# EAGLE schematic MySens-GWeasySensRS485-003 (EAGLE 7.6.0)
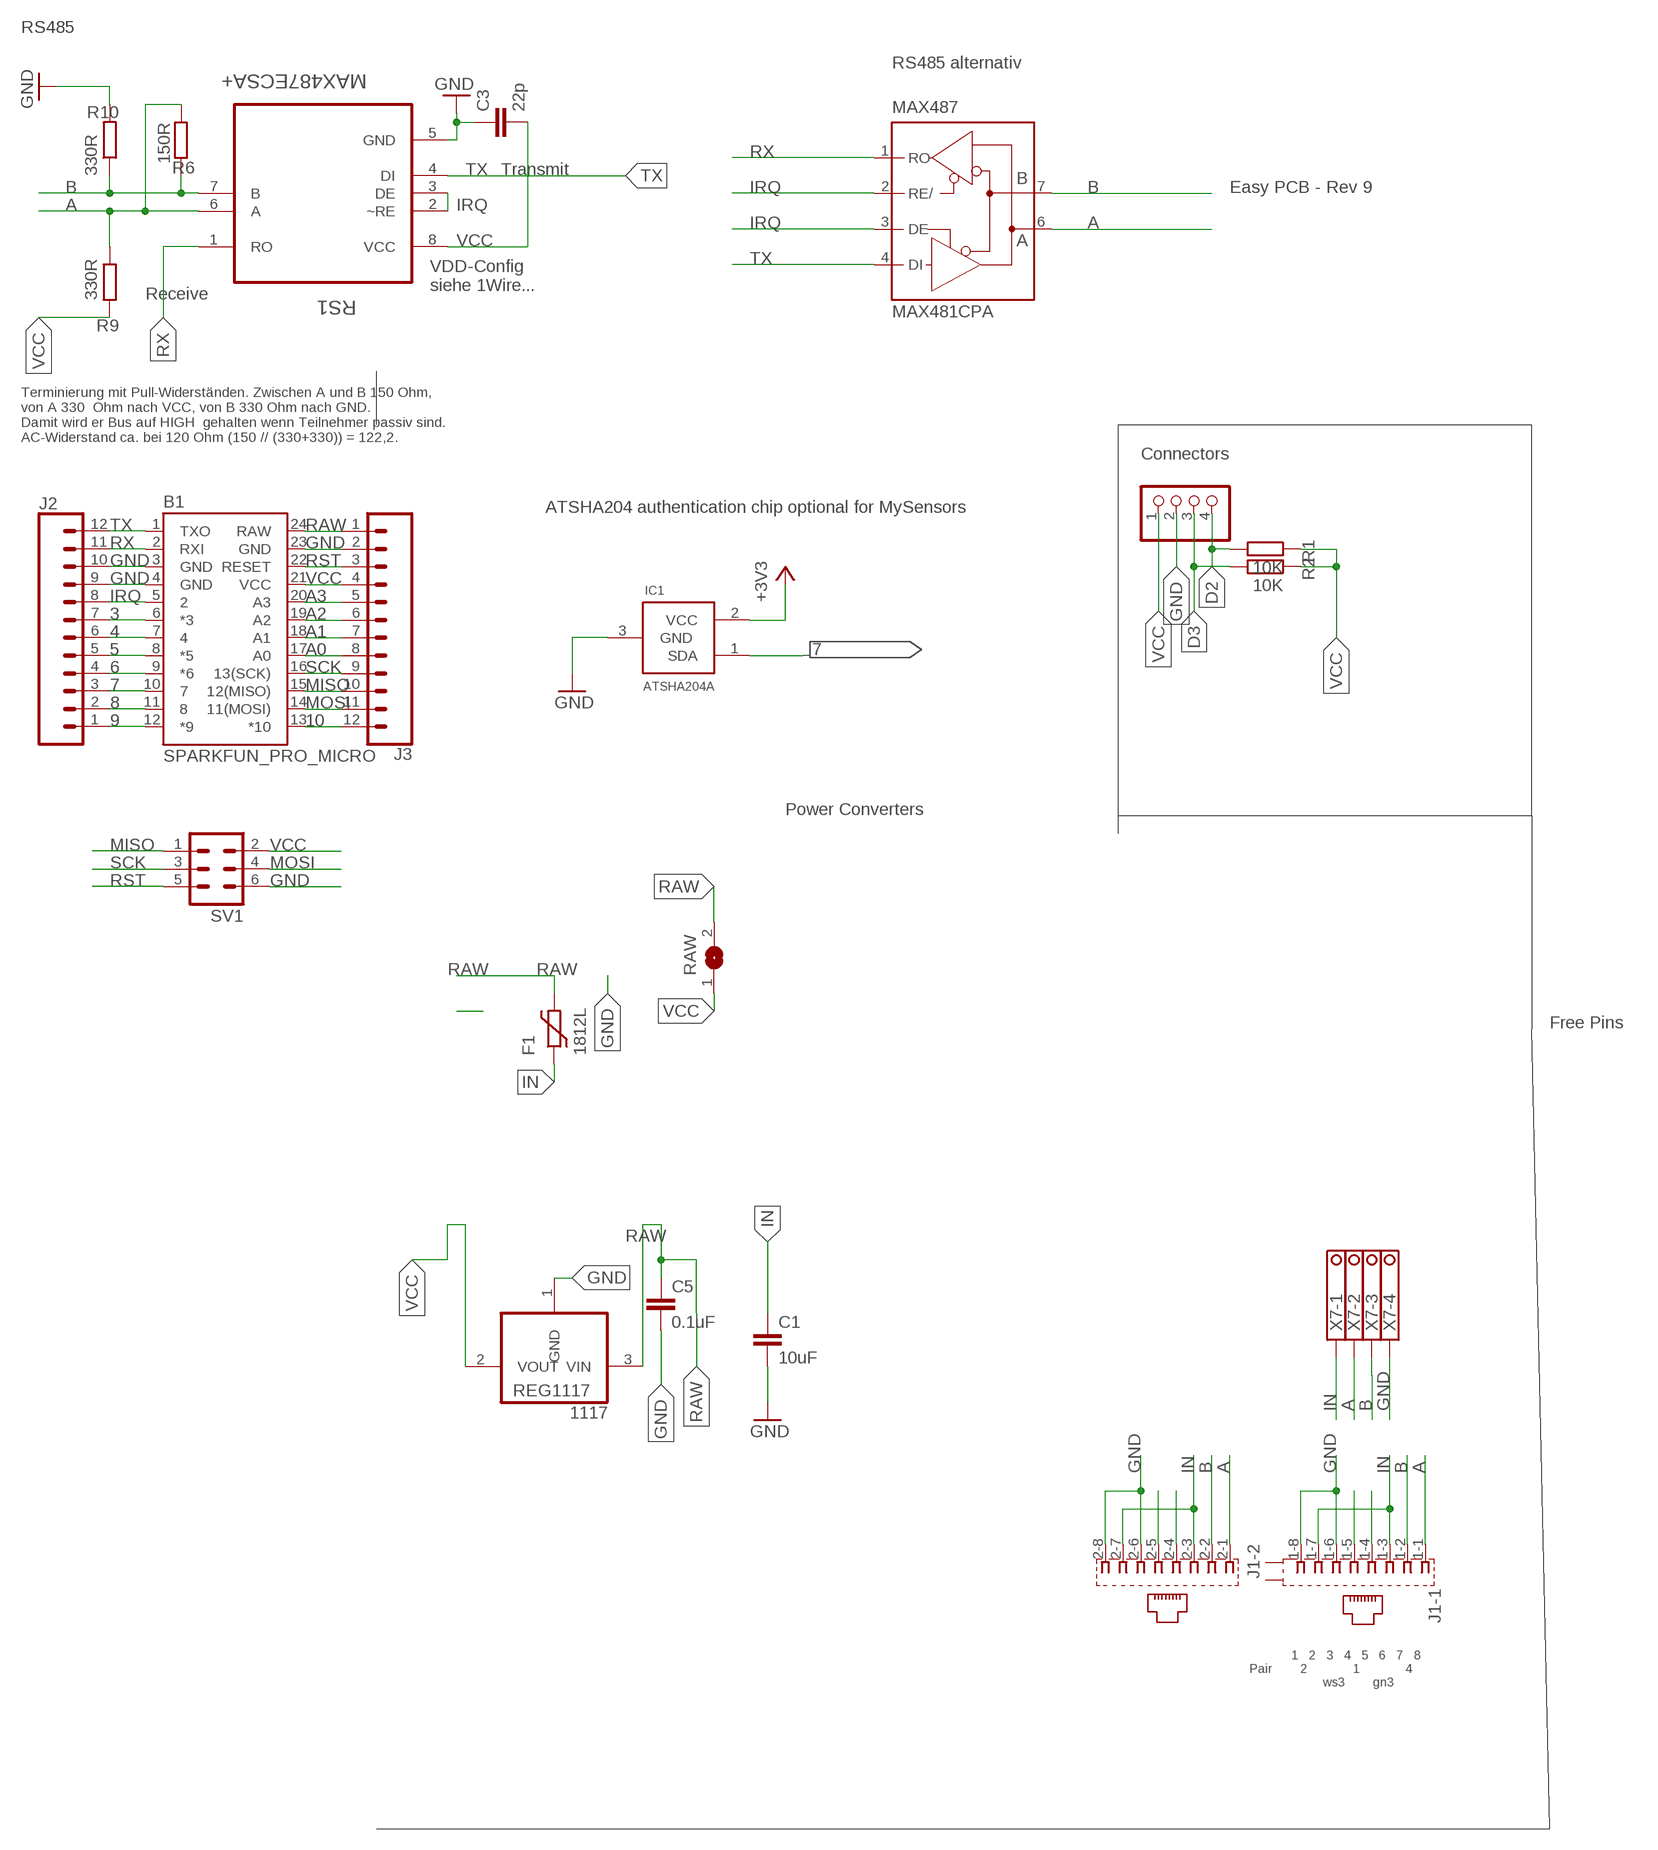
[diagram p0: schematic, sheet 1]

## Parts
1117  REG1117  [SOT223]
B1  SPARKFUN_PRO_MICRO  [SPARKFUN_PRO_MICRO]
C1  10uF  CAP0805  [0805]
C3  22p  C-EUC0805  [C0805]
C5  0.1uF  C-EUC1206  [C1206]
F1  1812L  [1812L]
IC1  ATSHA204A  [SOT23]
J1  557570-1  [557570-1]
J2  CONN_12  [1X12]
J3  CONN_12  [1X12]
JP10  PINHD-1X04_2.54-S  [1X04-S]
MAX487  MAX481CPA  [DIL08]
R1  10K  R-EU_R0805  [R0805]
R2  10K  R-EU_R0805  [R0805]
R6  150R  R-EU_R0805  [R0805]
R9  330R  R-EU_R0805  [R0805]
R10  330R  R-EU_R0805  [R0805]
RAW  SJ  [SJ]
RS1  MAX487ECSA+  [SOIC127P600X175-8N]
SV1  MA03-2  [MA03-2]
X7  1751264  [1751264]

## Nets
3: B1.6(*3) J2.7
3V3: IC1.2(VCC) ; supply symbol labelled +3V3
4: B1.7 J2.6
5: B1.8(*5) J2.5
6: B1.9(*6) J2.4
7: B1.10 IC1.1(SDA) J2.3
8: B1.11 J2.2
9: B1.12(*9) J2.1
10: B1.13(*10) J3.12
A: J1.1-1 J1.2-1 MAX487.6(A) R6.1 R9.2 RS1.6(A) X7.2
A0: B1.17(A0) J3.8
A1: B1.18(A1) J3.7
A2: B1.19(A2) J3.6
A3: B1.20(A3) J3.5
B: J1.1-2 J1.2-2 MAX487.7(B) R6.2 R10.1 RS1.7(B) X7.3
D2: JP10.4 R1.2
D3: JP10.3 R2.2
GND [Power]: 1117.1(GND) B1.3(GND) B1.4(GND) B1.23(GND) C1.2 C3.1 C5.2 IC1.3(GND) J1.1-6 J1.1-8 J1.2-6 J1.2-8 J2.9 J2.10 J3.2 JP10.2 R10.2 RS1.5(GND) SV1.6 X7.4
IN [Power]: C1.1 F1.P$1 J1.1-3 J1.1-7 J1.2-3 J1.2-7 X7.1
IRQ: B1.5 J2.8 MAX487.2(RE/) MAX487.3(DE) RS1.2(~RE) RS1.3(DE)
MISO: B1.15(12(MISO)) J3.10 SV1.1
MOSI: B1.14(11(MOSI)) J3.11 SV1.4
N$1: J1.2-4
N$5: J1.2-5
N$9: J1.1-4
N$10: J1.1-5
RAW: 1117.3(VIN) B1.24(RAW) C5.1 F1.P$2 J3.1 RAW.2
RST: B1.22(RESET) J3.3 SV1.5
RX: B1.2(RXI) J2.11 MAX487.1(RO) RS1.1(RO)
SCK: B1.16(13(SCK)) J3.9 SV1.3
TX: B1.1(TXO) J2.12 MAX487.4(DI) RS1.4(DI)
VCC [Power]: 1117.2(VOUT) B1.21(VCC) C3.2 J3.4 JP10.1 R1.1 R2.1 R9.1 RAW.1 RS1.8(VCC) SV1.2
Unconnected: J1.G1(-1:S2) J1.G3(-1:S1)

## Notes on the sheet
- RS485
- RS485 alternativ
- Transmit
- Easy PCB - Rev 9
- VDD-Config
  siehe 1Wire...
- Receive
- Terminierung mit Pull-Widerständen. Zwischen A und B 150 Ohm,
  von A 330  Ohm nach VCC, von B 330 Ohm nach GND. 
  Damit wird er Bus auf HIGH  gehalten wenn Teilnehmer passiv sind.
  AC-Widerstand ca. bei 120 Ohm (150 // (330+330)) = 122,2.
- Connectors
- ATSHA204 authentication chip optional for MySensors
- Power Converters
- Free Pins
- 1   2   3   4   5   6   7   8
  Pair        2             1             4
                       ws3        gn3

## Power pins joined to a net without a drawn wire
GND: MAX487.5(GND)
VCC: MAX487.8(VCC)

## Library data of the parts
1117 = burr-brown:REG1117: 800mA and 1A Low Dropout (LDO) Positive Regulator 1.8V, 2.5V, 2.85V, 3.3V, 5V, and Adj; MPN: REG1117; OC_FARNELL: 1097566; OC_NEWARK: 14P6981
B1 = SparkFun-Boards:SPARKFUN_PRO_MICRO: SparkFun Pro Micro Atmega32U4 compatible footprint. SparkFun Products: 3.3V/8MHz <https://www.sparkfun.com/products/12587> 5V/16MHz <https://www.sparkfun.com/products/12640>
C1 = SparkFun-Passives:CAP: Capacitor Standard 0603 ceramic capacitor, and 0.1" leaded capacitor.
C3 C5 = rcl:C-EU: CAPACITOR, European symbol
F1 = ptc-littlefuse:1812L
IC1 = Sensor:ATSHA204A
J1 = con-amp:557570-1: AMP connector
J2 J3 = SparkFun-Connectors:CONN_12: Multi connection point. Often used as Generic Header-pin footprint for 0.1 inch spaced/style header connections On any of the 0.1 inch spaced packages, you can populate with these: Break Away Headers - Straight <https://www.sparkfun.com/products/116> (PRT-00116) Break Away Male Headers - Right Angle <https://www.sparkfun.com/products/553> (PRT-00553) Female Headers <https://www.sparkfun.com/products/115> (PRT-00115) Break Away Headers - Machine Pin <https://www.sparkfun.com/products/117> (PRT-00117) Break Away Female Headers - Swiss Machine Pin <https://www.sparkfun.com/products/743> (PRT-00743) For SCREWTERMINALS and SPRING TERMINALS visit here: Screw Terimnals on SparkFun.com <https://www.sparkfun.com/search/results?term=Screw+Terminals> (5mm/3.5mm/2.54mm spacing) This device is also useful as a general connection point to wire up your design to another part of your project. Our various solder wires solder well into these plated through hole pads. Hook-Up Wire - Assortment (Stranded, 22 AWG) <https://www.sparkfun.com/products/11375> (PRT-11375) Hook-Up Wire - Assortment (Solid Core, 22 AWG) <https://www.sparkfun.com/products/11367> (PRT-11367) View the entire wire category on our website here <https://www.sparkfun.com/categories/141> Special notes: Molex polarized connector foot print use with SKU : PRT-08231 with associated crimp pins and housings. 1MM SMD Version SKU: PRT-10208 NOTES ON THE VARIANTS LOCK and LOCK_LONGPADS... This footprint was designed to help hold the alignment of a through-hole component (i.e. 6-pin header) while soldering it into place. You may notice that each hole has been shifted either up or down by 0.005 of an inch from it's more standard position (which is a perfectly straight line). This slight alteration caused the pins (the squares in the middle) to touch the edges of the holes. Because they are alternating, it causes a "brace" to hold the component in place. 0.005 has proven to be the perfect amount of "off-center" position when using our standard breakaway headers. Although looks a little odd when you look at the bare footprint, once you have a header in there, the alteration is very hard to notice. Also,if you push a header all the way into place, it is covered up entirely on the bottom side.
JP10 = pinhead-2:PINHD-1X04: PIN HEADER
MAX487 = maxim-4:MAX481CPA: RS485 TRANSEIVER
R1 R2 R6 R9 R10 = rcl:R-EU_: RESISTOR, European symbol
RAW = jumper:SJ: SMD solder JUMPER
RS1 = Maxim_By_element14_Batch_1:MAX487ECSA+: Low-Power, Slew-Rate-Limited RS-485/RS-422 Transceivers; MPN: MAX487ECSA+; OC_FARNELL: 9724532; OC_NEWARK: 68K4803; PACKAGE: SOIC-8; SUPPLIER: Maxim
SV1 = con-lstb:MA03-2: PIN HEADER; OC_FARNELL: unknown; OC_NEWARK: unknown
X7 = con-phoenix-350:1751264: MKDS 1/ 4-3,5 Printklemme Nennstrom: 10 A Bemessungsspannung: 160 V Raster: 3,5 mm Polzahl: 4 Montageart: Löten Anschlussart: Schraubanschluss Anschlussrichtung vom Leiter zur Platine: 0° Source: http://eshop.phoenixcontact.com .. 1751264.pdf; MPN: 1751264; OC_FARNELL: unknown; OC_NEWARK: 10R0934

## Net classes
0 default: width 0.305 mm
1 Power: width 0.508 mm